# EAGLE design velocimeter-freescale-v2 (EAGLE 5.10)
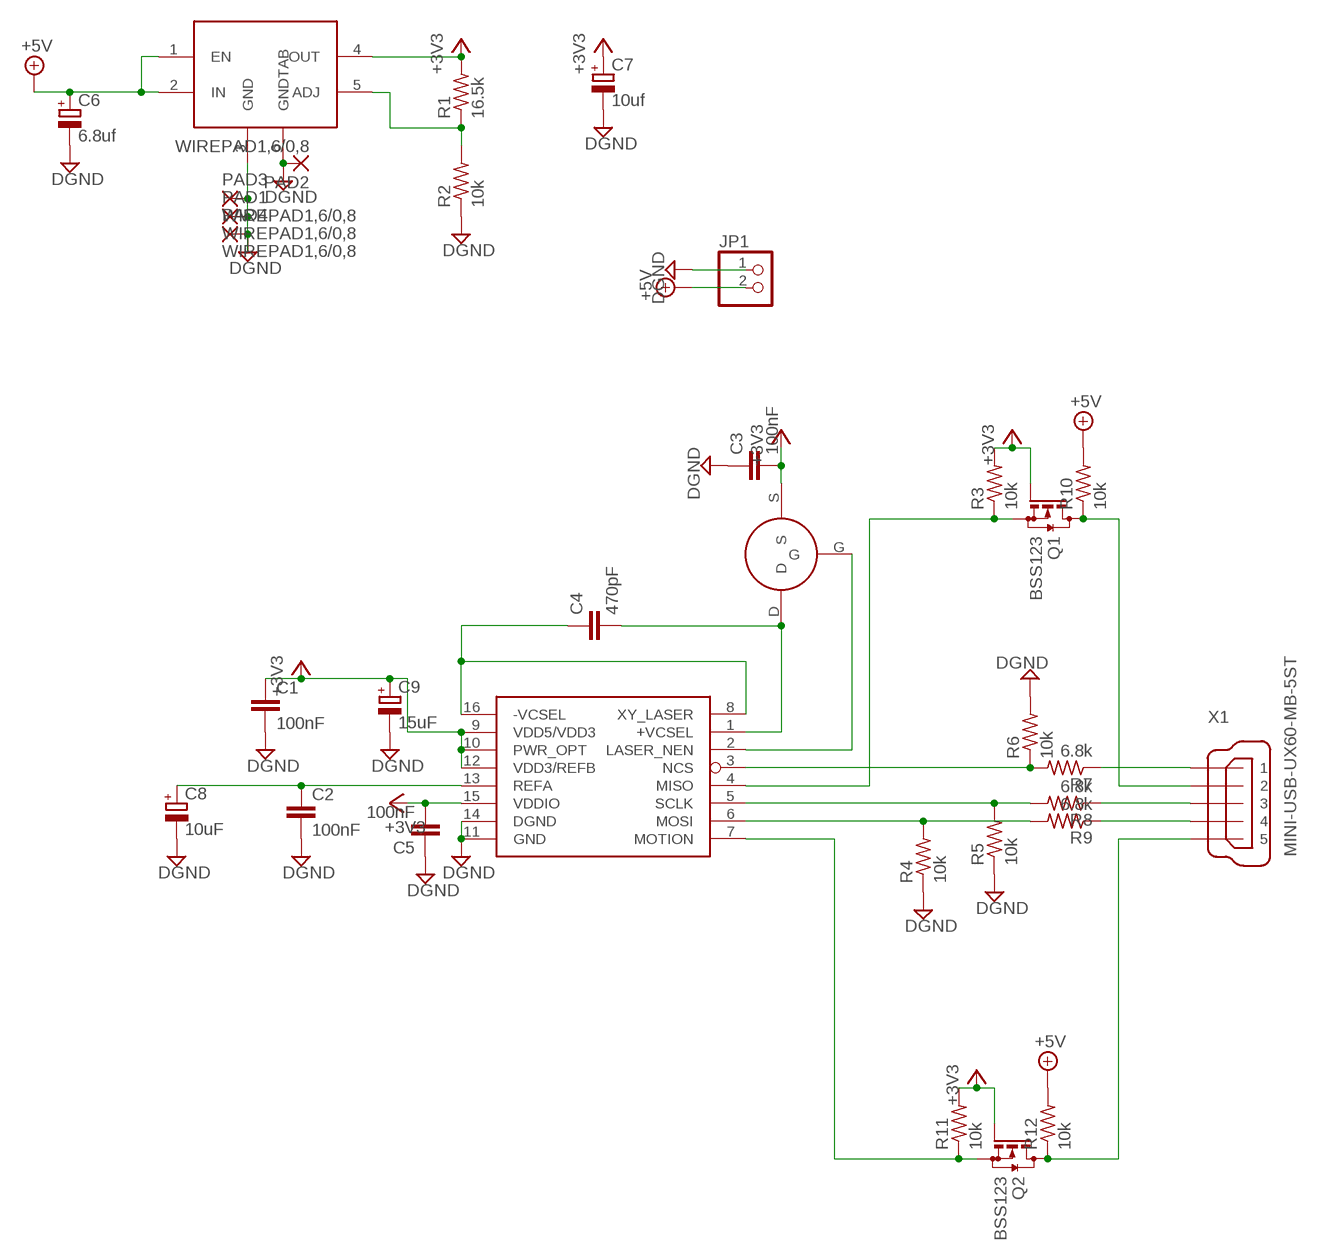
[diagram p0: schematic, sheet 1]

## Parts
C1  100nF  C-EUC0603  [C0603]
C2  100nF  C-EUC0603  [C0603]
C3  100nF  C-EUC0603  [C0603]
C4  470pF  C-EUC0603  [C0603]
C5  100nF  C-EUC0603  [C0603]
C6  6.8uf  CPOL-EUE2,5-6E  [E2,5-6E]
C7  10uf  CPOL-EUE2,5-6E  [E2,5-6E]
C8  10uF  CPOL-EUE2,5-6E  [E2,5-6E]
C9  15uF  CPOL-EUE2,5-6E  [E2,5-6E]
JP1  PINHD-1X2  [1X02]
PAD1  WIREPAD1,6/0,8  [1,6/0,8]
PAD2  WIREPAD1,6/0,8  [1,6/0,8]
PAD3  WIREPAD1,6/0,8  [1,6/0,8]
PAD4  WIREPAD1,6/0,8  [1,6/0,8]
Q1  BSS123  [SOT23]
Q2  BSS123  [SOT23]
R1  16.5k  R-US_R0603  [R0603]
R2  10k  R-US_R0603  [R0603]
R3  10k  R-US_R0603  [R0603]
R4  10k  R-US_R0603  [R0603]
R5  10k  R-US_R0603  [R0603]
R6  10k  R-US_R0603  [R0603]
R7  6.8k  R-US_R0603  [R0603]
R8  6.8k  R-US_R0603  [R0603]
R9  6.8k  R-US_R0603  [R0603]
R10  10k  R-US_R0603  [R0603]
R11  10k  R-US_R0603  [R0603]
R12  10k  R-US_R0603  [R0603]
U$1  ADNS-9500  [ADNS-9500]
U$2  NTA4151P  [SOT416]
U$3  MIC29310  [TO263-5]
X1  MINI-USB-UX60-MB-5ST  [UX60-MB-5ST]

## Nets
+3V3: C1.1 C3.2 C5.2 C7.+ C9.+ Q1.1(G) Q2.1(G) R1.2 R3.2 R11.2 U$1.9(VDD5/VDD3) U$1.10(PWR_OPT) U$1.12(VDD3/REFB) U$1.15(VDDIO) U$2.S U$3.4(OUT)
+5V: C6.+ JP1.2 R10.2 R12.2 U$3.1(EN) U$3.2(IN)
DGND: C1.2 C2.2 C3.1 C5.1 C6.- C7.- C8.- C9.- JP1.1 PAD1.1(P) PAD2.1(P) PAD3.1(P) PAD4.1(P) R2.1 R4.1 R5.1 R6.2 U$1.11(GND) U$1.14(DGND) U$3.3(GND) U$3.6(GNDTAB)
N$1: C2.1 C8.+ U$1.13(REFA)
N$2: Q1.2(S) R3.1 U$1.4(MISO)
N$3: Q1.3(D) R10.1 X1.2
N$5: R5.2 R8.2 U$1.5(SCLK)
N$6: C4.1 U$1.8(XY_LASER) U$1.16(-VCSEL)
N$7: C4.2 U$1.1(+VCSEL) U$2.D
N$8: Q2.2(S) R11.1 U$1.7(MOTION)
N$9: R1.1 R2.2 U$3.5(ADJ)
N$10: U$1.2(LASER_NEN) U$2.G
N$11: R4.2 R9.2 U$1.6(MOSI)
N$12: R7.1 X1.1
N$13: R6.1 R7.2 U$1.3(NCS)
N$14: R8.1 X1.3
N$15: R9.1 X1.4
N$16: Q2.3(D) R12.1 X1.5

## Library data of the parts
C1-C5 = resistor:C-EU: CAPACITOR, European symbol
C6-C9 = resistor:CPOL-EU: POLARIZED CAPACITOR, European symbol
JP1 = pinhead:PINHD-1X2: PIN HEADER
PAD1-PAD4 = wirepad:WIREPAD: Wire PAD connect wire on PCB
Q1 Q2 = transistor-small-signal:BSS123: N-CHANNEL MOS FET
R1-R12 = resistor:R-US_: RESISTOR, American symbol
U$1 = mouse:ADNS-9500: Avago Mouse sensor, 150 ips adns-9500; ADNS-9500: mouse sensor
U$2 = mouse:NTA4151P
U$3 = linear:MIC29310
X1 = con-hirose:MINI-USB-: MINI USB Connector Source: http://www.hirose.co.jp/cataloge_hp/e24000019.pdf

## Board
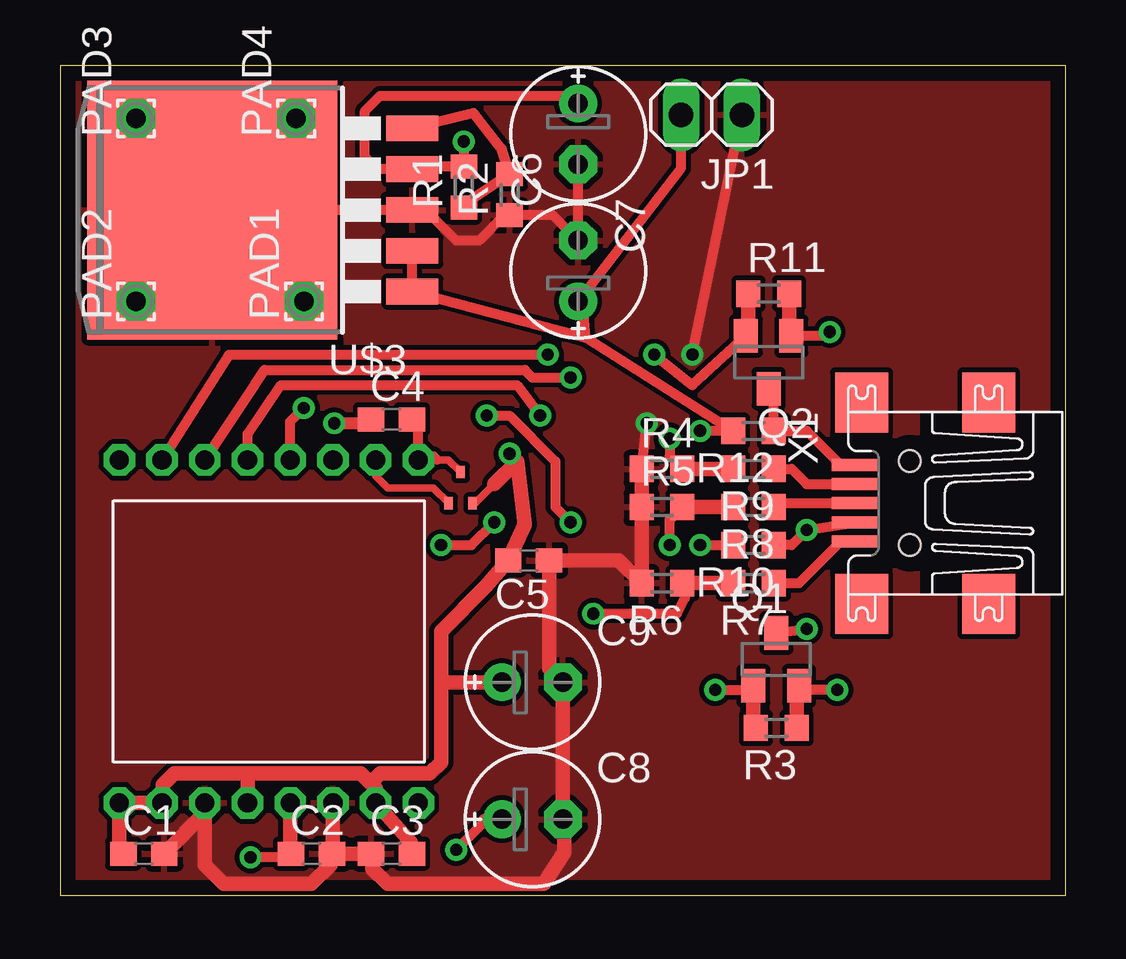
[diagram p1: board, top side]
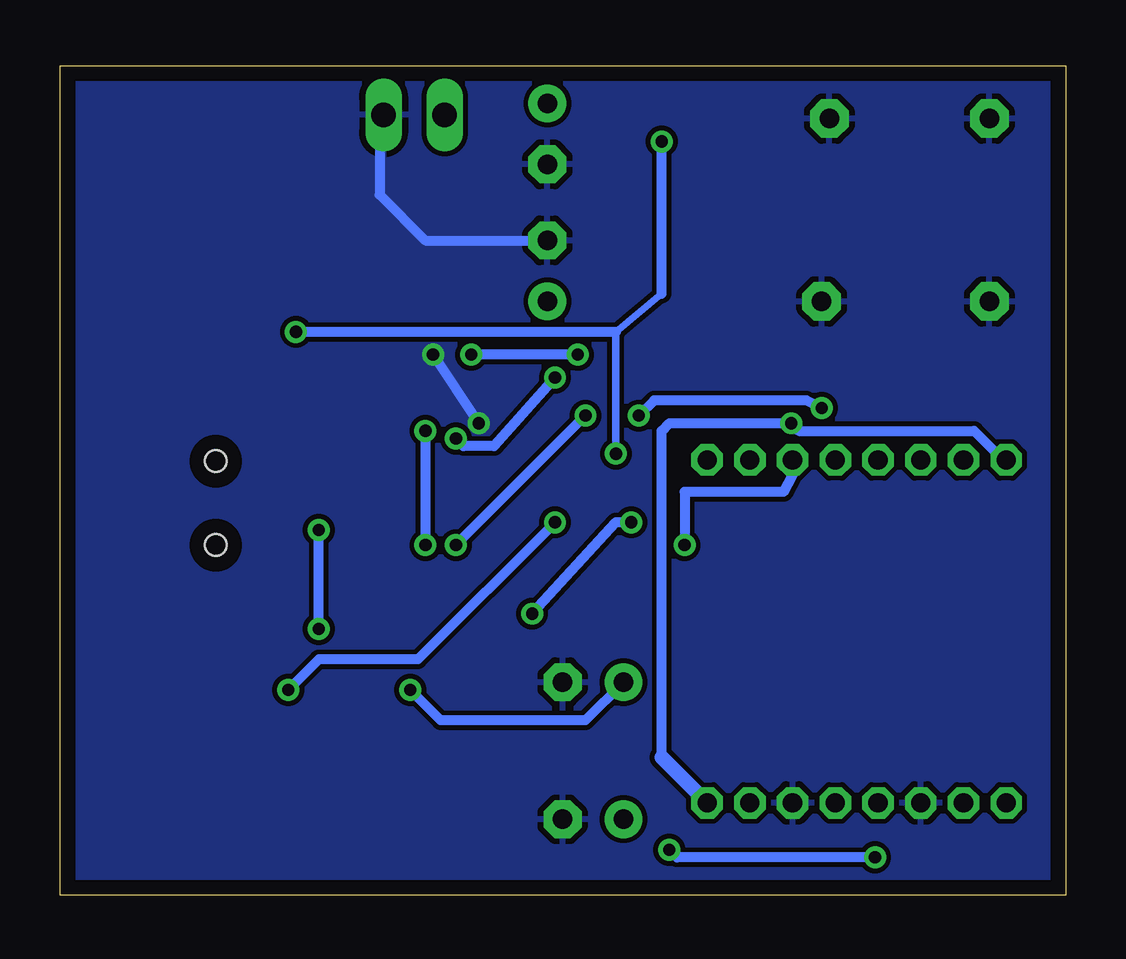
[diagram p2: board, bottom side, seen from below]

Size 41.9 x 34.6 mm. Coordinates in mm from the lower left corner, seen from the top.
Outline: 0,0 41.9,0 41.9,34.6 0,34.6 0,0
Copper layers (1*16): Top 0.035mm / dielectric 1.5mm / Bottom 0.035mm
Design rules "spec express pcb": minimum track width 6mil, minimum drill 19mil, track to track 8mil, track to pad 8mil, pad to pad 8mil, via to via 8mil, smd to smd 8mil, copper to edge 25mil, drill to drill 21mil, minimum pad ring 10mil, minimum via ring 8mil, stop-mask expansion 4mil, vias tented up to drill 0mil, thermal gap 10mil

### Footprints (pad centres in the part's own frame; a part is rotated, then mirrored left to right if it is on the bottom)
C0603 = smd 1.1 x 1: 1 -0.85,0; 2 0.85,0
E2,5-6E = drill 0.813 pad 1.575 round: + -1.27,0 | drill 0.813 pad 1.575 octagon: - 1.27,0
1X02 = drill 1.016 long: 1 -1.27,0; 2 1.27,0
1,6/0,8 = drill 0.813 pad 1.6 octagon: 1 0,0
SOT23 = smd 1 x 1.4: 1 -0.95,-1.1; 2 0.95,-1.1; 3 0,1.1
R0603 = smd 1 x 1.1: 1 -0.85,0; 2 0.85,0
ADNS-9500 = drill 0.8 octagon: 1 12.71,12.6; 2 10.93,12.6; 3 9.15,12.6; 4 7.37,12.6; 5 5.59,12.6; 6 3.81,12.6; 7 2.03,12.6; 8 0.25,12.6; 9 0.25,-1.7; 10 2.03,-1.7; 11 3.81,-1.7; 12 5.59,-1.7; 13 7.37,-1.7; 14 9.15,-1.7; 15 10.93,-1.7; 16 12.71,-1.7
SOT416 = smd 0.356 x 0.508: D 0.5,1.295; G 0,0; S 1,0
TO263-5 = smd 1.067 x 2.159: 1 -3.404,-5.791; 2 -1.702,-5.791; 3 0,-5.791; 4 1.702,-5.791; 5 3.404,-5.791 | smd 10.8 x 10.41: 6 0,2.54
UX60-MB-5ST = smd 2 x 0.5: 1 2.25,1.6; 2 2.25,0.8; 3 2.25,0; 4 2.25,-0.8; 5 2.25,-1.6 | smd 2.2 x 2.5: M1 -3.3,-4.2; M2 -3.3,4.2; M3 2,4.2; M4 2,-4.2 | hole 0.9: 0,-1.75; 0,1.75

### Placement (x,y rotation side)
C1  3.49,1.75 0 top
C2  10.48,1.75 0 top
C3  13.81,1.75 0 top
C4  13.81,19.84 0 top
C5  19.53,13.97 180 top
C6  21.59,26.04 90 top
C7  21.59,31.75 270 top
C8  19.68,3.17 0 top
C9  19.68,8.89 0 top
JP1  27.15,32.54 180 top
PAD1  10.16,24.77 90 top
PAD2  3.17,24.77 90 top
PAD3  3.17,32.38 90 top
PAD4  9.84,32.38 90 top
Q1  29.84,9.84 0 top
Q2  29.53,22.23 180 top
R1  16.83,29.53 90 top
R2  18.73,29.21 90 top
R3  29.84,6.99 180 top
R4  25.08,17.78 0 top
R5  25.08,16.19 0 top
R6  25.08,13.02 180 top
R7  28.89,13.02 180 top
R8  28.89,16.19 180 top
R9  28.89,17.78 180 top
R10  28.89,14.61 180 top
R11  29.53,25.08 0 top
R12  28.89,19.37 180 top
U$1  2.22,5.56 0 top
U$2  16.19,16.35 0 top
U$3  8.89,28.57 90 top
X1  35.4,16.35 180 top

### Tracks (layer width: path | path; a pad name or v marks a point on that pad's centre or on a via)
+3V3  (via drill 0.51)
  Top 0.305: U$2.S 17.3,16.35 18.1,17.14 18.41,17.46 | 19.05,18.1 18.41,17.46 | v18.73,18.41 18.73,17.78 18.41,17.46
  Top 0.406: C7.+ 21.59,33.34 13.34,33.34 12.7,32.7 12.7,30.8 13.22,30.28 U$3.4 14.68,30.38 R1.2 v16.83,31.43 | Q1.1 28.73,8.57 v27.3,8.57 | v32.07,23.5 31.92,23.32 Q2.1
  Top 0.61: C1.1 2.47,1.92 U$1.9 U$1.10 4.29,4.53 4.29,4.6 4.76,5.08 7.81,5.08 | 12.94,4.68 12.54,5.08 7.81,5.08 | 12.94,4.68 13.15,4.47 U$1.15 14.61,2.22 C3.2 | 7.81,5.08 U$1.12 | 18.1,17.14 19.05,18.1 19.37,15.46 C5.2 17.73,12.86 15.88,11.01 15.88,8.89 | 12.94,4.68 13.34,5.08 15.4,5.08 15.88,5.56 15.88,8.89 | 15.88,8.89 C9.+ | R11.2 30.38,23.43 Q2.1 | Q1.1 28.89,7.08 R3.2
  Bottom 0.305: 16.83,25.08 18.73,23.5 v18.73,18.41
  Bottom 0.406: v27.3,8.57 26.04,7.3 20,7.3 C9.+ | 18.73,23.5 v32.07,23.5 | 16.83,25.08 v16.83,31.43
+5V  (via drill 0.51)
  Top 0.406: 21.91,23.27 U$3.1 U$3.2 | 21.91,23.27 21.82,24.22 C6.+ 25.88,30.32 JP1.2 | 21.91,23.27 R12.2 v26.67,19.37 | v26.67,14.61 R10.2
  Bottom 0.406: v26.67,19.37 v26.67,14.61
DGND  (via drill 0.51)
  Top 0.254: PAD3.1 3.49,32.38 6.35,29.53 | 6.04,28.2 7.36,28.2 10.16,25.4 PAD1.1
  Top 0.406: v26.35,22.54 JP1.1 | R4.1 v24.45,19.68 | 6.04,28.2 PAD2.1 | 6.04,28.2 U$3.6 U$3.3 15,28.26 15.56,28.26 16.51,27.3 17.46,27.3 18.52,28.36 R2.1 20.54,28.36 C6.- C7.- | 8.31,31.05 9.21,31.75 6.04,28.2 | 8.31,31.05 6.35,29.53 | 9.84,32.24 PAD4.1 | 9.84,32.24 8.01,30.41 | 9.84,32.24 9.5,32.24 8.31,31.05
  Top 0.61: C1.2 6.03,3.44 U$1.11 6.03,1.27 6.83,0.48 10.48,0.48 11.27,1.27 11.27,1.69 C2.2 | U$1.14 11.37,1.79 C2.2 | C2.2 C3.1 13.02,1.69 13.02,1.11 13.65,0.48 20.16,0.48 21.01,1.8 21.01,3.12 C8.- C9.- 20.38,9.47 C5.1 23.28,13.97 R6.2 R5.1 R4.1
  Bottom 0.406: v24.45,19.68 v26.35,22.54 | C6.- 26.67,27.3 28.57,29.21 28.57,32.38 JP1.1
  pour Top: 0,0 0,34.29 41.91,34.29 41.91,0
  pour Bottom: 0,0 0,34.29 41.91,34.29 41.91,0
N$1  (via drill 0.51)
  Top 0.406: v16.51,1.91 17.73,3.12 | v7.94,1.59 9.47,1.59 C2.1
  Top 0.61: U$1.13 9.59,1.78 C2.1 | C8.+ 18.36,3.12 17.73,3.12
  Bottom 0.406: v16.51,1.91 16.19,1.59 v7.94,1.59
N$2  (via drill 0.51)
  Top 0.406: v21.27,15.56 20.64,16.19 20.64,18.1 18.73,20 v17.78,20 | v32.38,8.57 30.96,8.57 Q1.2 | U$1.4 9.59,19.75 v10.16,20.32
  Top 0.61: R3.1 30.7,8.64 Q1.2
  Bottom 0.406: v21.27,15.56 26.99,9.84 31.11,9.84 v32.38,8.57 | v10.16,20.32 10.79,20.64 17.14,20.64 v17.78,20
N$3  (via drill 0.51)
  Top 0.406: v31.11,15.23 X1.2 | v31.11,15.23 30.48,14.61 R10.1 | v31.11,15.24 v31.11,15.23 | Q1.3 v31.11,11.11
  Bottom 0.406: v31.11,11.11 v31.11,15.24
N$5  (via drill 0.51)
  Top 0.406: R5.2 25.4,15.66 v25.4,14.61 | v20,20 19.05,21.27 9.21,21.27 7.81,19.24 U$1.5
  Top 0.61: R5.2 R8.2
  Bottom 0.406: v20,20 v25.4,14.61
N$6  (via drill 0.51)
  Top 0.508: v11.43,19.68 12.8,19.68 C4.1
  Bottom 0.406: 2.47,18.35 2.79,18.35 3.81,19.37 11.11,19.37 v11.43,19.68 16.51,19.68 16.83,19.37 16.83,5.75
  Bottom 0.508: 2.47,18.35 U$1.8
  Bottom 0.61: U$1.16 16.83,5.75
N$7
  Top 0.305: U$1.1 15.72,18.16 16.18,18.16 U$2.D
  Top 0.406: 15.72,18.16 15.56,18.32 | U$1.1 14.93,19.46 C4.2
N$8  (via drill 0.51)
  Top 0.406: U$1.7 7.05,22.54 v20.32,22.54 | v24.77,22.54 26.35,21.27 Q2.2
  Top 0.61: R11.1 28.68,23.43 Q2.2
  Bottom 0.406: v20.32,22.54 v24.77,22.54
N$9
  Top 0.406: U$3.5 17.23,32.61 18.41,31.11 R2.2 16.83,28.79 R1.1
N$10
  Top 0.305: U$1.2 13.15,17.49 13.65,16.99 15.56,16.99 U$2.G
N$11  (via drill 0.51)
  Top 0.406: U$1.6 8.51,21.91 19.37,21.91 19.68,21.59 v21.27,21.59 | R4.2 25.4,18.31 v25.4,19.05
  Top 0.61: R4.2 R9.2
  Bottom 0.406: v25.4,19.05 25.08,18.73 23.81,18.73 v21.27,21.59
N$12
  Top 0.406: X1.1 32.53,14.75 30.8,13.02 R7.1
N$13  (via drill 0.51)
  Top 0.406: v15.88,14.61 17.14,14.61 v18.1,15.56 | v22.23,11.75 25.72,11.75 26.04,12.38 26.04,12.91 R6.1
  Top 0.61: R6.1 R7.2
  Bottom 0.406: U$1.3 11.37,17.52 11.75,16.83 15.88,16.83 v15.88,14.61 | v18.1,15.56 18.73,15.56 v22.23,11.75
N$14
  Top 0.406: X1.3 29.9,16.35 R8.1
N$15
  Top 0.406: X1.4 31.11,17.15 30.48,17.78 R9.1
N$16
  Top 0.406: X1.5 32.53,17.95 31.11,19.37 R12.1 29.74,20.91 Q2.3